# Altium schematic sheet DAC.SchDoc: DAC
size 420 x 297 mm; Author: P. Zdunek; DrawnBy: P. Zdunek; Organization: WUT ISE; Address1: PW ISE; Address2: Nowowiejska 15/19 00-665 Warsaw; Address3: p.zdunek90@gmail.com; DocumentNumber: 6; Revision: 1.0; SheetNumber: 6; SheetTotal: 37; ModifiedBy: -; CheckedDate: -; DivGrp: WUT ISE; Designer: P. Zdunek; Title2: Fast Stabilizer; ModifiedDate: -; ProjectName: Sensor Box
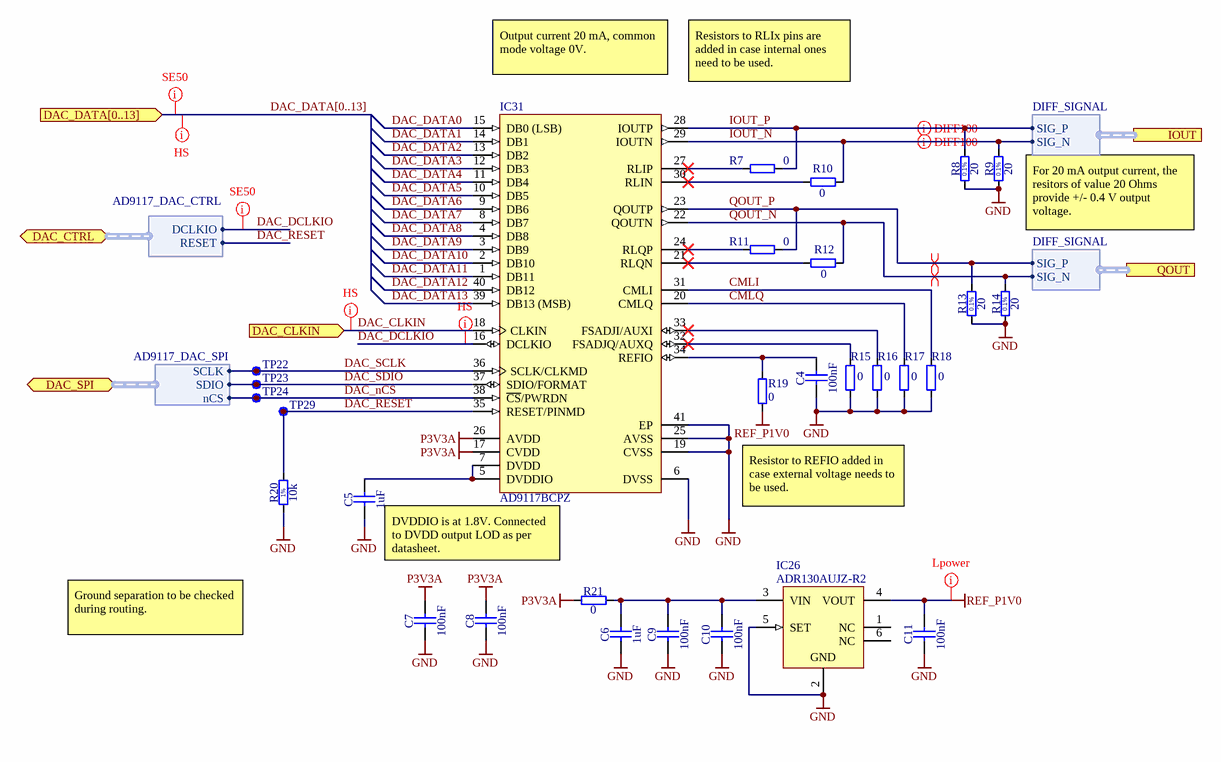
[diagram p0: DAC.SchDoc]

## Parts
C4  100nF  [CAPC1005X55N]
C5  1uF  [CAPC1005X55N]
C6  1uF  [CAPC1005X55N]
C7  100nF  [CAPC1005X55N]
C8  100nF  [CAPC1005X55N]
C9  100nF  [CAPC1005X55N]
C10  100nF  [CAPC1005X55N]
C11  100nF  [CAPC1005X55N]
IC26  ADR130AUJZ-R2  [ADI-UJ-6_N]
IC31  AD9117BCPZ  [CP-40-1_N]
R7  0  [RESC1005X40N]
R8  20  [RESC1608X55N]
R9  20  [RESC1608X55N]
R10  0  [RESC1005X40N]
R11  0  [RESC1005X40N]
R12  0  [RESC1005X40N]
R13  20  [RESC1608X55N]
R14  20  [RESC1608X55N]
R15  0  [RESC1005X40N]
R16  0  [RESC1005X40N]
R17  0  [RESC1005X40N]
R18  0  [RESC1005X40N]
R19  0  [RESC1005X40N]
R20  10k  [RESC1005X40N]
R21  0  [RESC1005X40N]
TP22  SMD Pad  [C100]  (value not drawn)  (no BOM)
TP23  SMD Pad  [C100]  (value not drawn)  (no BOM)
TP24  SMD Pad  [C100]  (value not drawn)  (no BOM)
TP29  SMD Pad  [C100]  (value not drawn)  (no BOM)

## Ports
DAC_CLKIN (in), DAC_CTRL (bidir, harness AD9117_DAC_CTRL), DAC_DATA[0..13] (in), DAC_SPI (bidir, harness AD9117_DAC_SPI), IOUT (harness DIFF_SIGNAL), QOUT (harness DIFF_SIGNAL)

## Harnesses
AD9117_DAC_SPI: SCLK, SDIO, nCS
DIFF_SIGNAL: SIG_P, SIG_N
AD9117_DAC_CTRL: DCLKIO, RESET

## Nets
GND: C4.1 C5.1 C6.1 C7.1 C8.1 C9.1 C10.1 C11.1 IC26.2(GND) IC26.5(SET) IC31.6(DVSS) IC31.19(CVSS) IC31.25(AVSS) IC31.41(EP) R8.1 R9.1 R13.1 R14.1 R15.1 R16.1 R17.2 R18.2 R20.1
P3V3A: C7.2 C8.2 IC31.17(CVDD) IC31.26(AVDD) R21.1
REF_P1V0: C11.2 IC26.4(VOUT) R19.1
CMLI: IC31.31(CMLI) R18.1
CMLQ: IC31.20(CMLQ) R17.1
DAC_CLKIN: IC31.18(CLKIN) ; port DAC_CLKIN
DAC_DATA0: IC31.15(DB0_(LSB))
DAC_DATA1: IC31.14(DB1)
DAC_DATA2: IC31.13(DB2)
DAC_DATA3: IC31.12(DB3)
DAC_DATA4: IC31.11(DB4)
DAC_DATA5: IC31.10(DB5)
DAC_DATA6: IC31.9(DB6)
DAC_DATA7: IC31.8(DB7)
DAC_DATA8: IC31.4(DB8)
DAC_DATA9: IC31.3(DB9)
DAC_DATA10: IC31.2(DB10)
DAC_DATA11: IC31.1(DB11)
DAC_DATA12: IC31.40(DB12)
DAC_DATA13: IC31.39(DB13_(MSB))
DAC_DCLKIO: IC31.16(DCLKIO) ; port DAC_CTRL.DCLKIO
DAC_nCS: IC31.38(~{CS}/PWRDN) TP24.1 ; port DAC_SPI.nCS
DAC_RESET: IC31.35(RESET/PINMD) R20.2 TP29.1 ; port DAC_CTRL.RESET
DAC_SCLK: IC31.36(SCLK/CLKMD) TP22.1 ; port DAC_SPI.SCLK
DAC_SDIO: IC31.37(SDIO/FORMAT) TP23.1 ; port DAC_SPI.SDIO
IOUT_N: IC31.29(IOUTN) R9.2 R10.1 ; port IOUT.SIG_N
IOUT_P: IC31.28(IOUTP) R7.1 R8.2 ; port IOUT.SIG_P
QOUT_N: IC31.22(QOUTN) R12.1 R14.2 ; port QOUT.SIG_N
QOUT_P: IC31.23(QOUTP) R11.1 R13.2 ; port QOUT.SIG_P
NetC4_2: C4.2 IC31.34(REFIO) R19.2
NetC5_2: C5.2 IC31.5(DVDDIO) IC31.7(DVDD)
NetC6_2: C6.2 C9.2 C10.2 IC26.3(VIN) R21.2
NetIC31_21: IC31.21(RLQN) R12.2
NetIC31_24: IC31.24(RLQP) R11.2
NetIC31_27: IC31.27(RLIP) R7.2
NetIC31_30: IC31.30(RLIN) R10.2
NetIC31_32: IC31.32(FSADJQ/AUXQ) R15.2
NetIC31_33: IC31.33(FSADJI/AUXI) R16.2

Not connected (* = marked no-connect by the designer): IC26 1(NC) 6(NC)

## Buses and harness runs
bus DAC_DATA[0..13] = port DAC_DATA[0..13]

## Layout directives
mark named Lpower: REF_P1V0
differential pair: IOUT_P, QOUT_N, QOUT_P
differential pair; differential pair class DIFF100: IOUT_N
net class SE50: (no net found under the mark), DAC_DCLKIO
net class HIGH_SPEED: (no net found under the mark), DAC_CLKIN, DAC_DCLKIO

## Notes on the sheet
- Output current 20 mA, common mode voltage 0V.
- Resistors to RLIx pins are added in case internal ones need to be used.
- (near R9) For 20 mA output current, the resitors of value 20 Ohms provide +/- 0.4 V output voltage.
- Resistor to REFIO added in case external voltage needs to be used.
- DVDDIO is at 1.8V. Connected to DVDD output LOD as per datasheet.
- Ground separation to be checked during routing.
- Project/Equipment
- Document
- Designer
- Drawn by
- Check.by
- Copyright WUT ISE 2020.
  This documentation describes Open Hardware and is licensed under the CERN OHL v.1.2. You may redistribute and modify this documentation under the terms of the CERN OHL v.1.2. (http://ohwr.org/CERNOHL). This documentation is distributed WITHOUT ANY EXPRESS OR IMPLIED WARRANTY, INCLUDING OF MERCHANTABILITY, SATISFACTORY QUALITY AND FITNESS FOR A PARTICULAR PURPOSE. Please see the CERN OHL v.1.2 for applicable conditions.
- Contact
- File
- Last Mod.
- Print Date
- Sheet
- Size
- A3
- of
- Rev
- (in symbol R0402_10K_1%_0.0625W_100PPM) 1%
- (in symbol R0603_20R_0.1%_0.063W_10PPM) 0.1%

## Library data of the parts
C4 = CC0402_100NF_16V_10%_X5R: Non-polarised capacitor; Part Description: SMD Multilayer Chip Ceramic Capacitor; Manufacturer: GENERIC; Manufacturer1 Part Number: GRM155R61C104KA88D; Voltage: 16V; TC: X5R; Tolerance: ±10%; Part Number: CC0402_100NF_16V_10%_X5R; Component Kind: Standard; Component Type: Standard; Pin Count: 2; Value: 100nF; Status: None; Manufacturer Part Number: CC0402_100NF_16V_10%_X5R; Case: 0402; Mounted: Yes; Socket: No; SMD: Yes; Sense: No; Manufacturer1 Example: MURATA; Manufacturer1 ComponentHeight: 0.55mm; HelpURL: \\cern.ch\dfs\Applications\Altium\Datasheets\CC0402_X5R_MURATA_GRM.pdf; Author: CERN DEM JLC; CreateDate: 10/12/2013; LatestRevisionDate: 10/12/2013
C5 C6 = CC0402_1UF_16V_10%_X5R: Non-polarised capacitor; Part Description: SMD Multilayer Chip Ceramic Capacitor; Manufacturer: GENERIC; Manufacturer1 Part Number: C1005X5R1C105KT; Voltage: 16V; TC: X5R; Tolerance: ±10%; Part Number: CC0402_1UF_16V_10%_X5R; Component Kind: Standard; Component Type: Standard; Pin Count: 2; Value: 1uF; Status: Preferred; Manufacturer Part Number: CC0402_1UF_16V_10%_X5R; Case: 0402; Mounted: Yes; Socket: No; SMD: Yes; Sense: No; Manufacturer1 Example: TDK; Manufacturer1 ComponentHeight: 0.55mm; HelpURL: \\cern.ch\dfs\Applications\Altium\Datasheets\CC0402_X5R_TDK_C.pdf; Author: CERN DEM JLC; CreateDate: 25/10/2012; LatestRevisionDate: 25/10/2012
C7-C11 = CC0402_100NF_16V_10%_X7R: Non-polarised capacitor; Part Description: SMD Multilayer Chip Ceramic Capacitor; Manufacturer: GENERIC; Manufacturer1 Part Number: GRM155R71C104KA88D; Voltage: 16V; TC: X7R; Tolerance: ±10%; Part Number: CC0402_100NF_16V_10%_X7R; Component Kind: Standard; Component Type: Standard; Pin Count: 2; Value: 100nF; Status: Not Recommended; Manufacturer Part Number: CC0402_100NF_16V_10%_X7R; Case: 0402; Mounted: Yes; Socket: No; SMD: Yes; Sense: No; Manufacturer1 Example: MURATA; Manufacturer1 ComponentHeight: 0.55mm; HelpURL: \\cern.ch\dfs\Applications\Altium\Datasheets\CC0402_X7R_MURATA_GRM.pdf; Author: CERN DEM JLC; CreateDate: 05/12/2013; LatestRevisionDate: 03/12/2007
IC26 = CMP-0784-00536-1: Precision Series Sub-Band Gap Voltage Reference, 1 V Output, 2 to 18 V Supply, Industrial, 6-pin SOT23 (UJ-6), Reel; Manufacturer: Analog Devices; Vout: 0.5V, 1V; Ref Out TC (ppm/C): 15; Min V Supply (V): 2; Max V Supply (V): 18; ComponentLink3Description: Package Specification; ComponentLink4Description: URL Link1; ComponentLink2URL: http://www.analog.com/static/imported-files/data_sheets/ADR130.pdf; ComponentLink3URL: http://www.analog.com/static/imported-files/packages/PKG_PDF/TSOT(UJ)/UJ_6.pdf; Code_JEDEC: MO-193-AA; ComponentLink2Description: Datasheet; ComponentLink1Description: Manufacturer URL; Packing: Reel; Mounting Technology: Surface Mount; PackageReference: UJ-6; PackageVersion: Dec-04; PartNumber: ADR130AUJZ-R2; ComponentLink4URL: Product URL:http://www.analog.com/en/special-linear-functions/voltage-references/adr130/products/product.html; Operating Temp Range: -40 to 125 degC; DatasheetVersion: Rev. B; PackageDescription: 6-Pin Thin Small Outline Transistor Package, Body 2.9 x 1.6 mm, Pitch 0.95 mm; ComponentLink1URL: http://www.analog.com/en/index.html
IC31 = CMP-0318-00565-2: Dual 14-Bit Low Power TxDAC Digital-to-Analog Converter, 0 to +70 degC, CP-40-1, Pb-Free, Tray; Manufacturer: Analog Devices; Generic Part Number: AD9117; Max V+: 3.3V; Single Supply: Yes; # DAC Outputs: 2; Resolution (Bits): 14; ComponentLink4Description: Product URL; ComponentLink2URL: http://www.analog.com/static/imported-files/data_sheets/AD9114_9115_9116_9117.pdf; Packing: Tray; PackageDescription: 40-Pin Lead Frame Chip Scale Package [LFCSP_VQ] Very Thin Quad; PackageVersion: Oct-2006; ComponentLink1URL: http://www.analog.com/en/index.html; Mounting Technology: Surface Mount; ComponentLink5URL: http://www.analog.com/en/digital-to-analog-converters/da-converters/ad9117/products/product.html#prod_cross_sell; ComponentLink3Description: Package Specification; PartNumber: AD9117BCPZ; PackageReference: CP-40-1; ComponentLink1Description: Manufacturer URL; ComponentLink4URL: http://www.analog.com/en/digital-to-analog-converters/da-converters/ad9117/products/product.html; ComponentLink3URL: http://www.analog.com/static/imported-files/packages/PKG_PDF/LFCSP(CP)/CP_40_1.pdf; ComponentLink2Description: Datasheet; ComponentLink5Description: Reference Design URL; Code_JEDEC: MO-220-VJJD-2; RoHS: Y; RevisionNote: Component URL fixed; DatasheetVersion: Rev.B
R7 R10-R12 R15-R19 R21 = R0402_0R_JUMPER: Resistor; Part Description: 1A (0.05R Max DC Resistance) Zero Ohm Jumper; Manufacturer: GENERIC; Manufacturer1 Part Number: 232270591001L; Part Number: R0402_0R_JUMPER; Component Kind: Standard; Component Type: Standard; Pin Count: 2; Value: 0; Status: Not recommended; Manufacturer Part Number: R0402_0R_JUMPER; Case: 0402; Mounted: Yes; Sense: No; Socket: No; SMD: Yes; Manufacturer1 Example: YAGEO PHYCOMP; Manufacturer1 ComponentHeight: 0.4mm; HelpURL: \\cern.ch\dfs\Applications\Altium\Datasheets\R0402_Phycomp_RC0402.pdf; Author: CERN DEM JLC; CreateDate: 03.12.2007; LatestRevisionDate: 17.10.2012
R8 R9 R13 R14 = R0603_20R_0.1%_0.063W_10PPM: Resistor - 0.1%; Part Description: Thin Film Chip Resistor; Manufacturer: GENERIC; Manufacturer1 Part Number: RN73C1J20RBTDF; PressFit: No; Power: 0.063W; TC: ±10ppm; Part Number: R0603_20R_0.1%_0.063W_10PPM; Component Kind: Standard; Component Type: Standard; Pin Count: 2; Value: 20; Status: Not Recommended; Manufacturer Part Number: R0603_20R_0.1%_0.063W_10PPM; Case: 0603; Mounted: Yes; Sense: No; Socket: No; SMD: Yes; Manufacturer1 Example: TYCO HOLSWORTHY; Manufacturer1 ComponentHeight: 0.5mm; HelpURL: \\cern.ch\dfs\Applications\Altium\Datasheets\R0603_Tyco_RN73.pdf; Author: CERN DEM JLC; CreateDate: 03-Dec-07; LatestRevisionDate: 13-Mar-08; Tolerance: ±0.1%
R20 = R0402_10K_1%_0.0625W_100PPM: Resistor - 1%; Part Description: General Purpose Thick Film Chip Resistor; Manufacturer: GENERIC; Manufacturer1 Part Number: 232270671003L; TC: ±100ppm/°C; PressFit: No; Part Number: R0402_10K_1%_0.0625W_100PPM; Component Kind: Standard; Component Type: Standard; Pin Count: 2; Value: 10k; Status: Not Recommended; Manufacturer Part Number: R0402_10K_1%_0.0625W_100PPM; Case: 0402; Mounted: Yes; Sense: No; Socket: No; SMD: Yes; Manufacturer1 Example: YAGEO PHYCOMP; Manufacturer1 ComponentHeight: 0.4mm; HelpURL: \\cern.ch\dfs\Applications\Altium\Datasheets\R0402_Phycomp_RC0402.pdf; Author: CERN DEM JLC; CreateDate: 03-Dec-07; LatestRevisionDate: 17-Oct-12; Power: 0.0625W; Tolerance: ±1%
TP22-TP24 TP29 = SMD_PAD_D1MM: Through Hole Pad; Part Description: 1mm Diameter SMD Pad; Mounted: No; Part Number: SMD_PAD_D1MM; Component Type: Standard (No BOM); Pin Count: 1; Family: SMD Pad; Socket: No; SMD: Yes; Sense: No; Status: None; ComponentHeight: 0mm; HelpURL: Undefined; Author: CERN DEM JLC; CreateDate: 10/10/2017; LatestRevisionDate: 10/10/2017; PackageDescription: 1mm Diameter SMD Pad